# EasyEDA schematic SCH_pcb-finallllllll_2024-04-22.json
TITLE: Sheet_1; REV: 1.0; Date: 2023-11-28; Sheet: 1/1; Drawn By: Arka; Company: Your Company
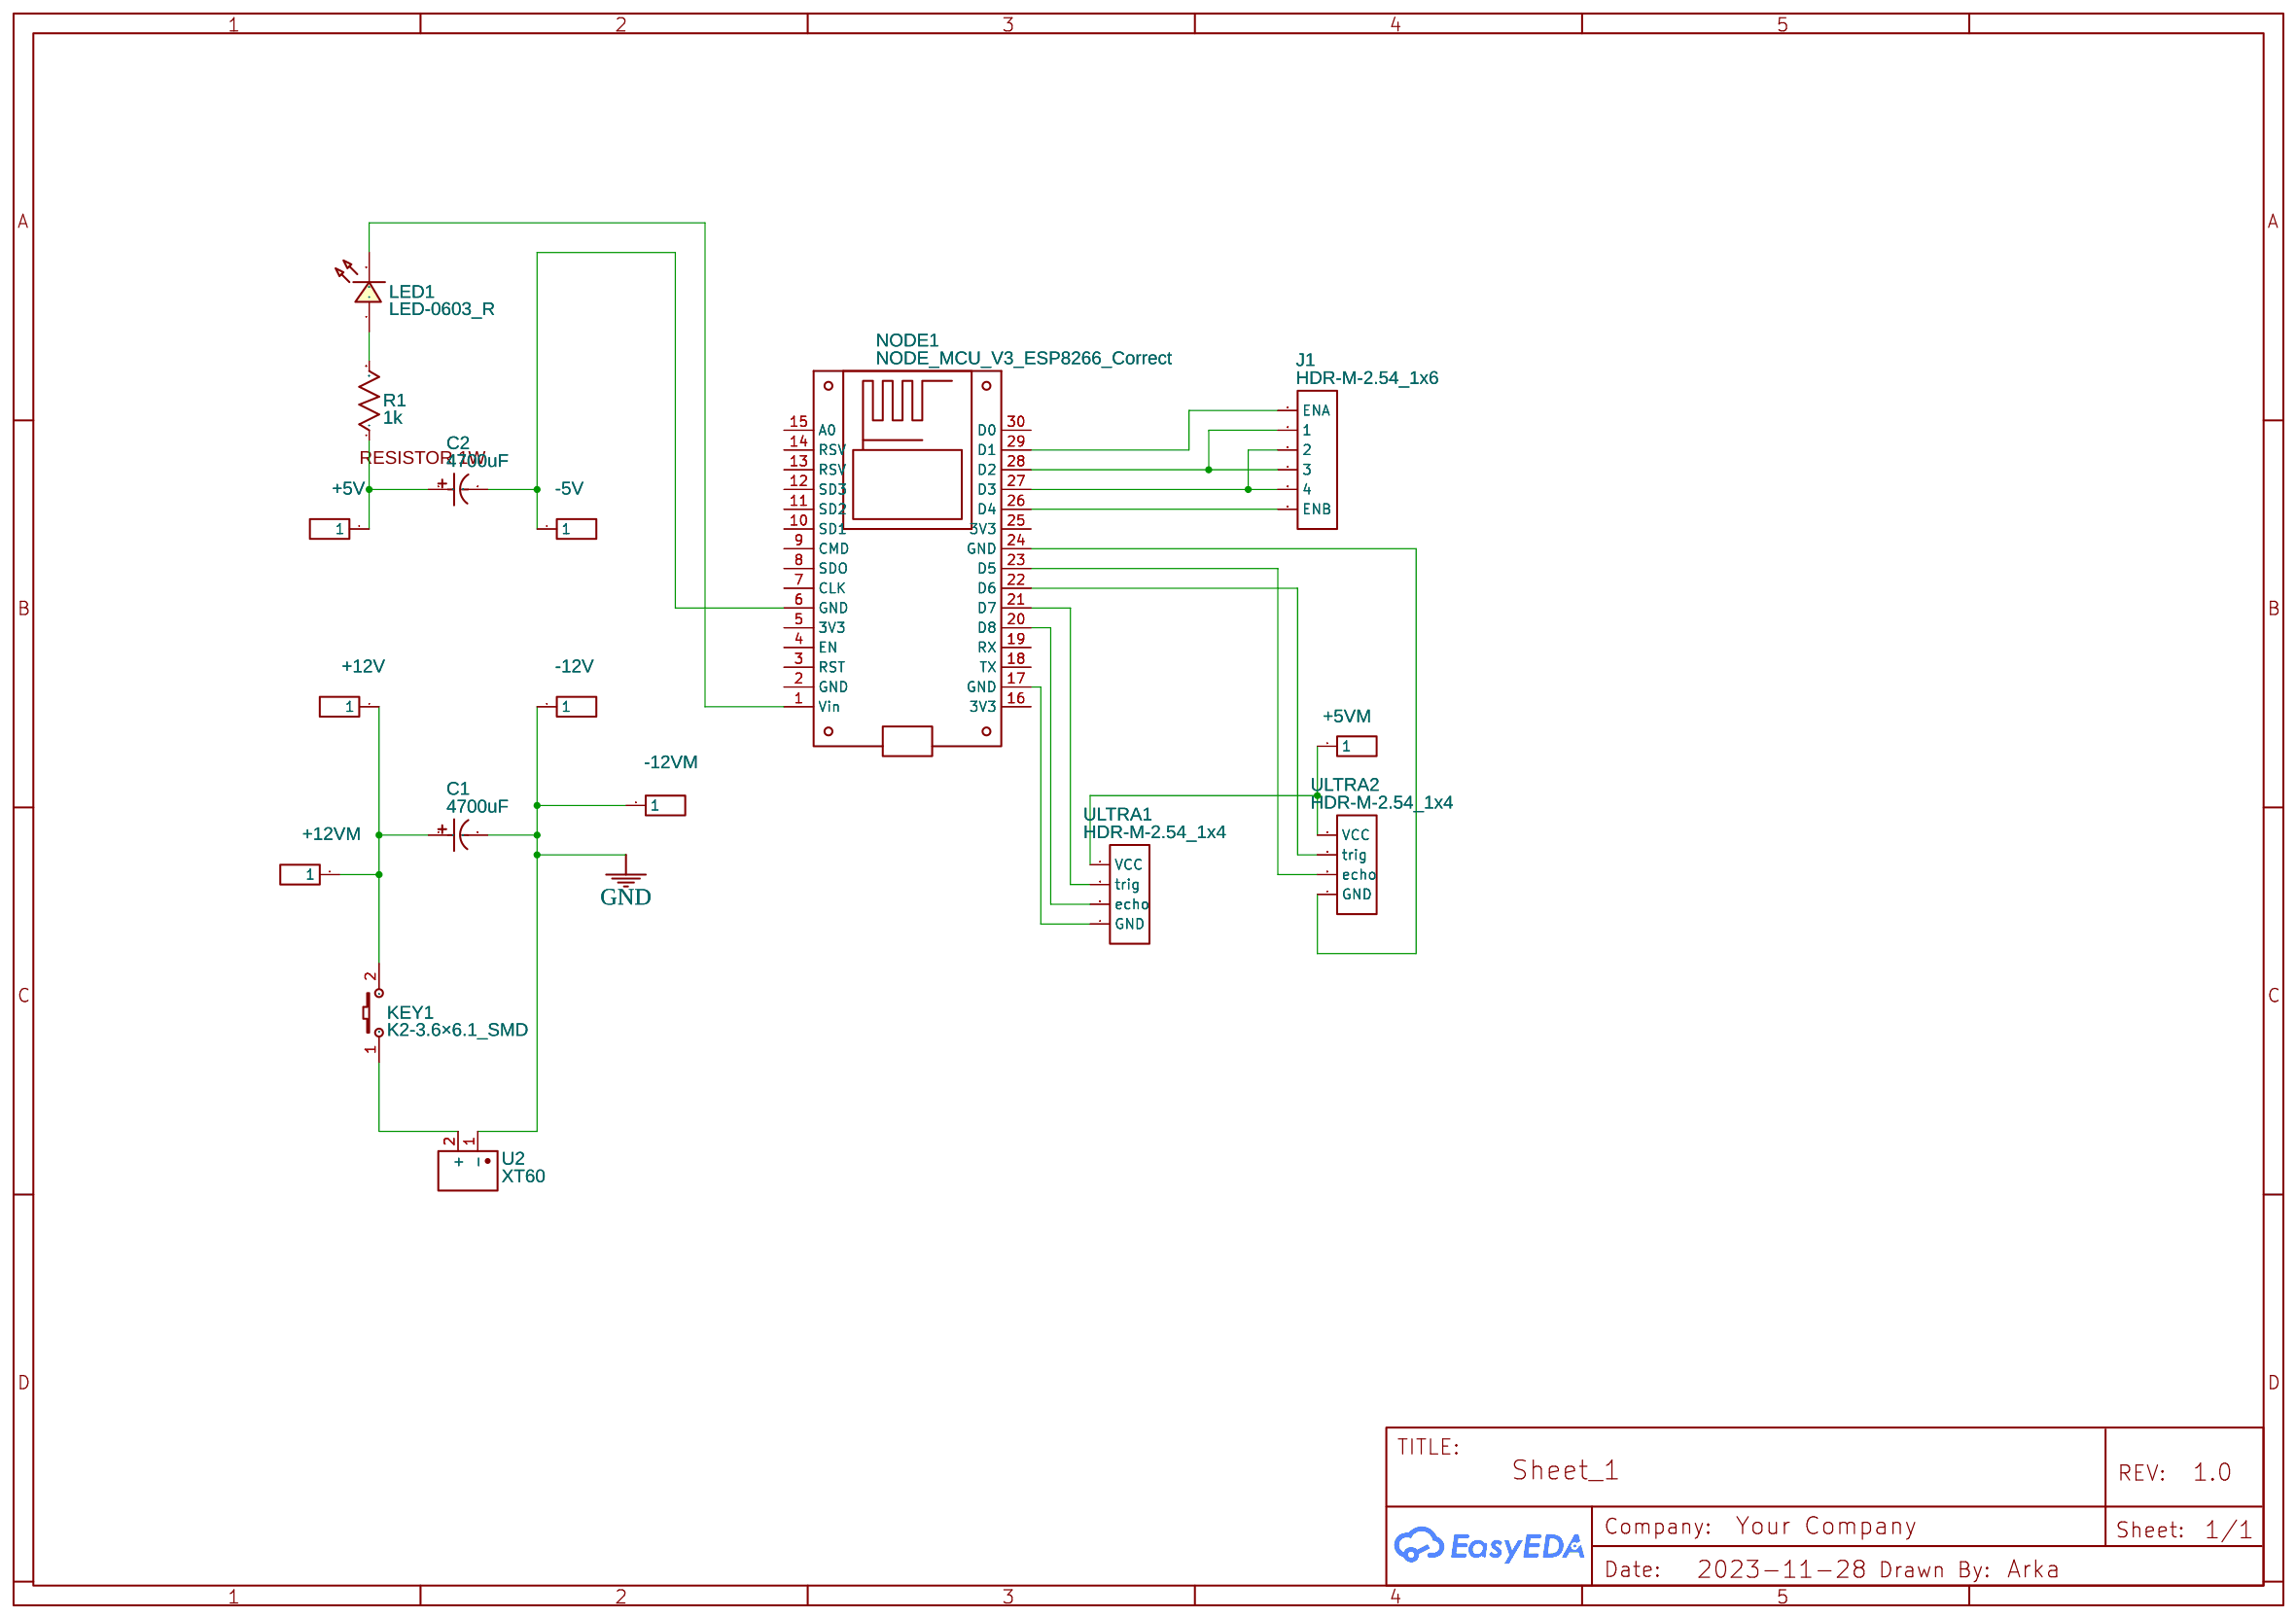
[diagram p0: schematic sheet]

## Parts
+5V  HDR-M-2.54_1x1  [HDR-M-2.54_1X1]
+5VM  HDR-M-2.54_1x1  [HDR-M-2.54_1X1]
+12V  HDR-M-2.54_1x1  [HDR-M-2.54_1X1]
+12VM  HDR-M-2.54_1x1  [HDR-M-2.54_1X1]
-5V  HDR-M-2.54_1x1  [HDR-M-2.54_1X1]
-12V  HDR-M-2.54_1x1  [HDR-M-2.54_1X1]
-12VM  HDR-M-2.54_1x1  [HDR-M-2.54_1X1]
C1  4700uF  [CAP-TH_BD18.0-P7.50-D1.2-FD]
C2  4700uF  [CAP-TH_BD18.0-P7.50-D1.2-FD]
J1  HDR-M-2.54_1x6  [HDR-M-2.54_1X6]
KEY1  K2-3.6×6.1_SMD  [KEY-SMD_2P-L6.2-W3.6-LS8.0]
LED1  LED-0603_R  [LED0603_RED]
NODE1  NODE_MCU_V3_ESP8266_Correct  [NODEMCU-12E;NODEMCU-ESP8266]
R1  1k  [RESISTOR 1W]
U2  XT60  [CONN-TH_XT60]
ULTRA1  HDR-M-2.54_1x4  [HDR-M-2.54_1X4]
ULTRA2  HDR-M-2.54_1x4  [HDR-M-2.54_1X4]

## Library data of the parts
+5V +5VM +12V +12VM -5V -12V -12VM = HDR-M-2.54_1x1: Supplier Part: C81276; Supplier: LCSC; Contributor: LCEDA_Lib
C1 C2 = 4700uF 35V 18*30: Supplier: LCSC; Manufacturer: CX(承兴); Manufacturer Part: KM478M035L30RR0VH2FP0; Supplier Part: C43354; JLCPCB Part Class: Extended Part; link: https://lcsc.com/eda_search?q=C43354&%26type=1&ref=editor
J1 = HDR-M-2.54_1x6: Supplier Part: C190819; Supplier: LCSC; Contributor: LCEDA_Lib
KEY1 = K2-3.6×6.1_SMD: Supplier Part: C118141; Supplier: LCSC; Manufacturer Part: K2-1107ST-A4SW-06; Contributor: LCEDA_Lib; 制造商: 韩国韩荣
LED1 = LED-0603_R: Manufacturer: EVERLIGHT(台湾亿光); Manufacturer Part: 19-217/R6C-AL1M2VY/3T; Supplier Part: C72044; Supplier: LCSC; Contributor: LCEDA_01
NODE1 = NODE_MCU_V3_ESP8266_Correct: Contributor: geogeporcel; Supplier: TME
R1 = R_0603_US: Contributor: LCEDA_Lib; Package Display: Yes
U2 = XT60: Contributor: lcsc; Supplier: LCSC; Supplier Part: C98733; Manufacturer: AMASS(艾迈斯); JLCPCB Part Class: Extended Part; link: https://lcsc.com/eda_search?q=C98733&%26type=1&ref=editor
ULTRA1 ULTRA2 = HDR-M-2.54_1x4: Supplier Part: C124378; Supplier: LCSC; Contributor: LCEDA_Lib

## Nets
GND: -12V.1 -12VM.1 C1.2 U2.1(-)
Net-(+5V-1): +5V.1 C2.1 R1.1
Net-(+5VM-1): +5VM.1 ULTRA1.1(VCC) ULTRA2.1(VCC)
Net-(+12V-1): +12V.1 +12VM.1 C1.1 KEY1.2
Net-(-5V-1): -5V.1 C2.2 NODE1.6(GND)
Net-(J1-1): J1.1(ENA) NODE1.29(D1)
Net-(J1-2): J1.2(1) J1.4(3) NODE1.28(D2)
Net-(J1-3): J1.3(2) J1.5(4) NODE1.27(D3)
Net-(J1-6): J1.6(ENB) NODE1.26(D4)
Net-(KEY1-1): KEY1.1 U2.2(+)
Net-(LED1-1): LED1.1 R1.2
Net-(LED1-2): LED1.2 NODE1.1(Vin)
Net-(NODE1-17): NODE1.17(GND) ULTRA1.4(GND)
Net-(NODE1-20): NODE1.20(D8) ULTRA1.3(echo)
Net-(NODE1-21): NODE1.21(D7) ULTRA1.2(trig)
Net-(NODE1-22): NODE1.22(D6) ULTRA2.2(trig)
Net-(NODE1-23): NODE1.23(D5) ULTRA2.3(echo)
Net-(NODE1-24): NODE1.24(GND) ULTRA2.4(GND)

Not connected (* = marked no-connect by the designer): NODE1 2(GND) 3(RST) 4(EN) 5(3V3) 7(CLK) 8(SDO) 9(CMD) 10(SD1) 11(SD2) 12(SD3) 13(RSV) 14(RSV) 15(A0) 16(3V3) 18(TX) 19(RX) 25(3V3) 30(D0)
